# EAGLE schematic midi2cv.2.1.main (EAGLE 7.5.0)
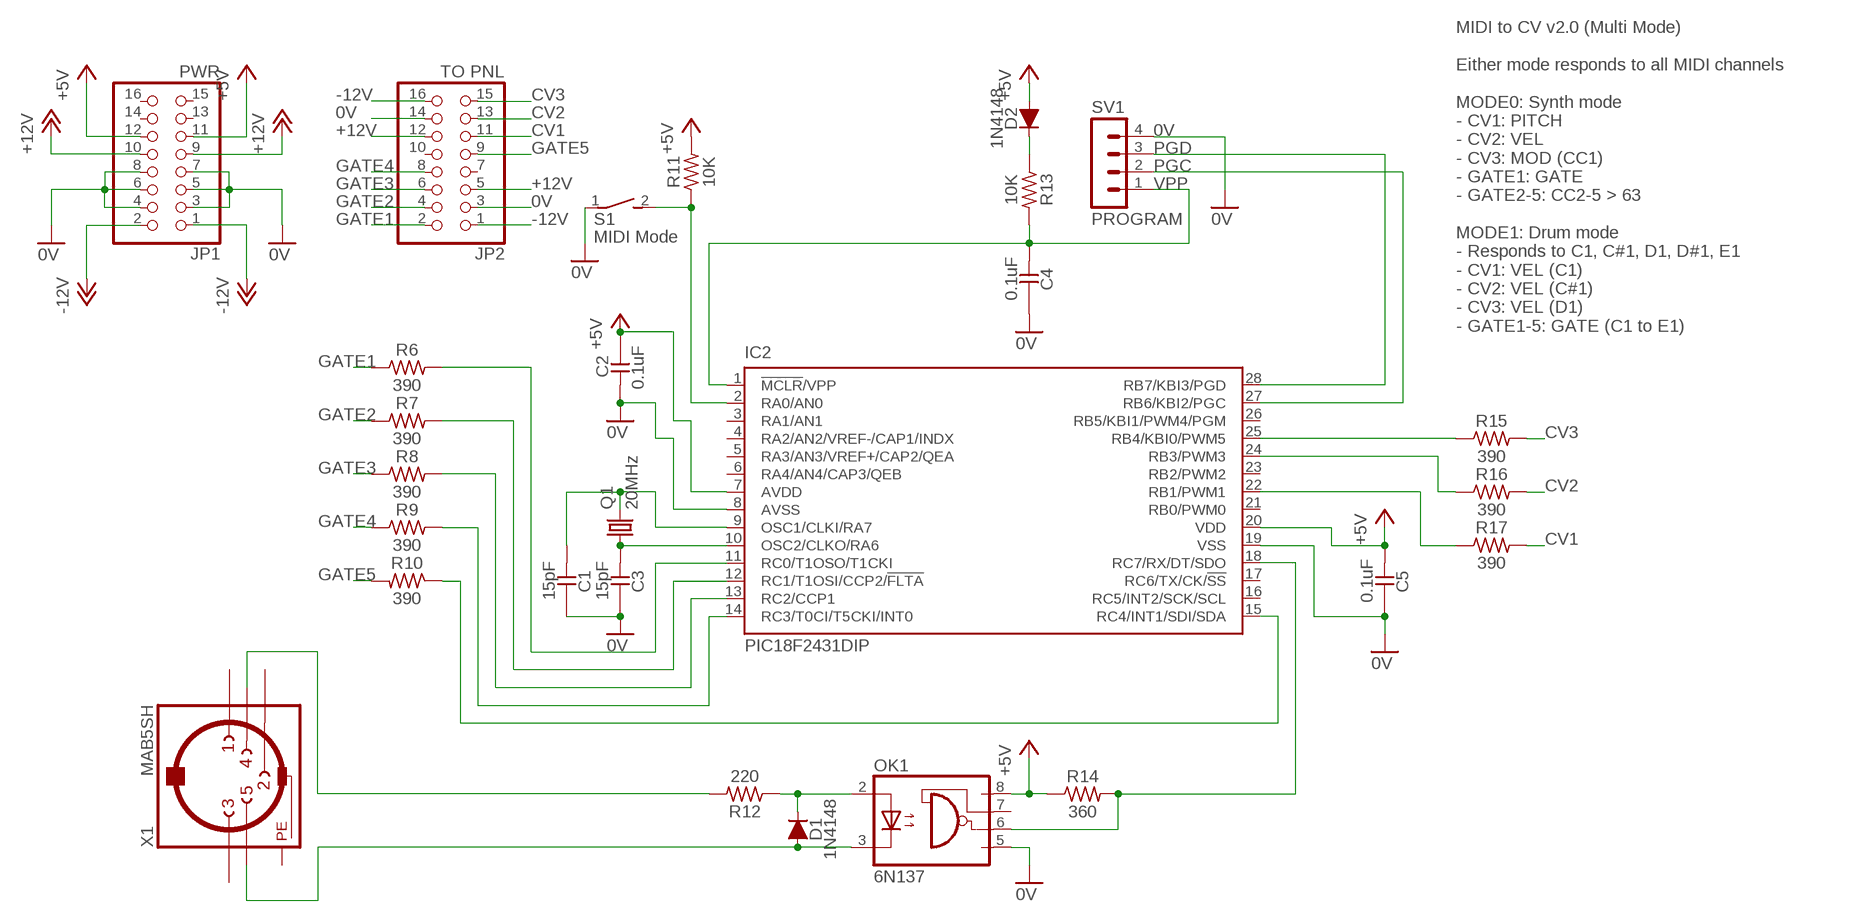
[diagram p0: schematic, sheet 1]

## Parts
C1  15pF  CC-US025-024X044  [C025-024X044]
C2  0.1uF  CC-US025-024X044  [C025-024X044]
C3  15pF  CC-US025-024X044  [C025-024X044]
C4  0.1uF  CC-US025-024X044  [C025-024X044]
C5  0.1uF  CC-US025-024X044  [C025-024X044]
D1  1N4148  [DO35-7]
D2  1N4148  [DO35-7]
IC2  PIC18F2431DIP  [DIL28-3]
JP1  PWR  PINHD-2X8  [2X08]
JP2  TO PNL  PINHD-2X8  [2X08]
OK1  6N137  [DIL08]
Q1  20MHz  CRYSTALHC49S  [HC49/S]
R6  390  R0309/10  [0309/10]
R7  390  R0309/10  [0309/10]
R8  390  R0309/10  [0309/10]
R9  390  R0309/10  [0309/10]
R10  390  R0309/10  [0309/10]
R11  10K  R0309/10  [0309/10]
R12  220  R0309/10  [0309/10]
R13  10K  R0309/10  [0309/10]
R14  360  R0309/10  [0309/10]
R15  390  R0309/10  [0309/10]
R16  390  R0309/10  [0309/10]
R17  390  R0309/10  [0309/10]
S1  MIDI Mode  DS01E  [DS-01]
SV1  PROGRAM  MA04-1  [MA04-1]
X1  MAB5SH  [MAB5SH]

## Nets
0V: C1.1 C2.2 C3.1 C4.1 C5.1 IC2.8(AVSS) IC2.19(VSS) JP1.3 JP1.4 JP1.5 JP1.6 JP1.7 JP1.8 JP2.3 JP2.14 OK1.5(GND) S1.1 SV1.4
+5V: C2.1 C5.2 D2.A IC2.7(AVDD) IC2.20(VDD) JP1.11 JP1.12 OK1.8(VCC) R11.2 R14.1
+12V: JP1.9 JP1.10 JP2.5 JP2.12
-12V: JP1.1 JP1.2 JP2.1 JP2.16
CV1: JP2.11 R17.2
CV2: JP2.13 R16.2
CV3: JP2.15 R15.2
GATE1: JP2.2 R6.1
GATE2: JP2.4 R7.1
GATE3: JP2.6 R8.1
GATE4: JP2.8 R9.1
GATE5: JP2.9 R10.2
N$1: D2.C R13.1
N$6: C3.2 IC2.10(OSC2/CLKO/RA6) Q1.1
N$9: R12.2 X1.4
N$10: D1.A OK1.3(C) X1.5
N$11: D1.C OK1.2(A) R12.1
N$13: IC2.18(RC7/RX/DT/SDO) OK1.6(VO) R14.2
N$16: IC2.25(RB4/KBI0/PWM5) R15.1
N$17: IC2.24(RB3/PWM3) R16.1
N$18: IC2.22(RB1/PWM1) R17.1
N$19: IC2.15(RC4/INT1/SDI/SDA) R10.1
N$20: IC2.2(RA0/AN0) R11.1 S1.2
N$26: IC2.11(RC0/T1OSO/T1CKI) R6.2
N$27: C1.2 IC2.9(OSC1/CLKI/RA7) Q1.2
N$28: IC2.12(RC1/T1OSI/CCP2/!FLTA) R7.2
N$29: IC2.13(RC2/CCP1) R8.2
N$30: IC2.14(RC3/T0CI/T5CKI/INT0) R9.2
PGC: IC2.27(RB6/KBI2/PGC) SV1.2
PGD: IC2.28(RB7/KBI3/PGD) SV1.3
VPP: C4.2 IC2.1(!MCLR!/VPP) R13.2 SV1.1
Unconnected: IC2.3(RA1/AN1) IC2.4(RA2/AN2/VREF-/CAP1/INDX) IC2.5(RA3/AN3/VREF+/CAP2/QEA) IC2.6(RA4/AN4/CAP3/QEB) IC2.16(RC5/INT2/SCK/SCL) IC2.17(RC6/TX/CK/!SS) IC2.21(RB0/PWM0) IC2.23(RB2/PWM2) IC2.26(RB5/KBI1/PWM4/PGM) JP1.13 JP1.14 JP1.15 JP1.16 JP2.7 JP2.10 OK1.7(VE) X1.1 X1.2 X1.3

## Notes on the sheet
- MIDI to CV v2.0 (Multi Mode)
  
  Either mode responds to all MIDI channels
  
  MODE0: Synth mode 
  - CV1: PITCH
  - CV2: VEL
  - CV3: MOD (CC1)
  - GATE1: GATE
  - GATE2-5: CC2-5 > 63
  
  MODE1: Drum mode
  - Responds to C1, C#1, D1, D#1, E1
  - CV1: VEL (C1)
  - CV2: VEL (C#1)
  - CV3: VEL (D1)
  - GATE1-5: GATE (C1 to E1)

## Power pins joined to a net without a drawn wire
PE: X1.PE X1.PE@(PE)

## Library data of the parts
C1-C5 = _common:CC-US: CAPACITOR, US symbol
D1 D2 = _common:1N4148: DIODE high speed (Philips)
IC2 = _common:PIC18F2*31: USB Microcontrollers with nanoWatt Technology High-Performance, Enhanced Flash, 28-Pin, Source: http://ww1.microchip.com/downloads/en/devicedoc/39616d.pdf; MF: MICROCHIP; MPN: PIC18F2431-I/SP
JP1 JP2 = pinhead:PINHD-2X8: PIN HEADER
OK1 = optocoupler:6N137: MOTOROLA OPTO COUPLER; MPN: 6N137; OC_FARNELL: 1328376; OC_NEWARK: 52M1895
Q1 = crystal:CRYSTAL: CRYSTAL; OC_FARNELL: 1667008; OC_NEWARK: unknown
R6-R17 = _common:R: RESISTOR, US symbol
S1 = switch-dil:DS01E: DIL/CODE SWITCH; OC_FARNELL: unknown; OC_NEWARK: unknown
SV1 = con-lstb:MA04-1: PIN HEADER; OC_FARNELL: unknown; OC_NEWARK: unknown
X1 = con-hirschmann:MAB5SH: Female CONNECTOR 5 pins 90 deg. with shield, horizontal (DIN 41524); OC_FARNELL: 809883; OC_NEWARK: unknown